# Altium schematic sheet MCU_BLE_Module.SchDoc
size Legal; SheetNumber: 2; SheetTotal: 4
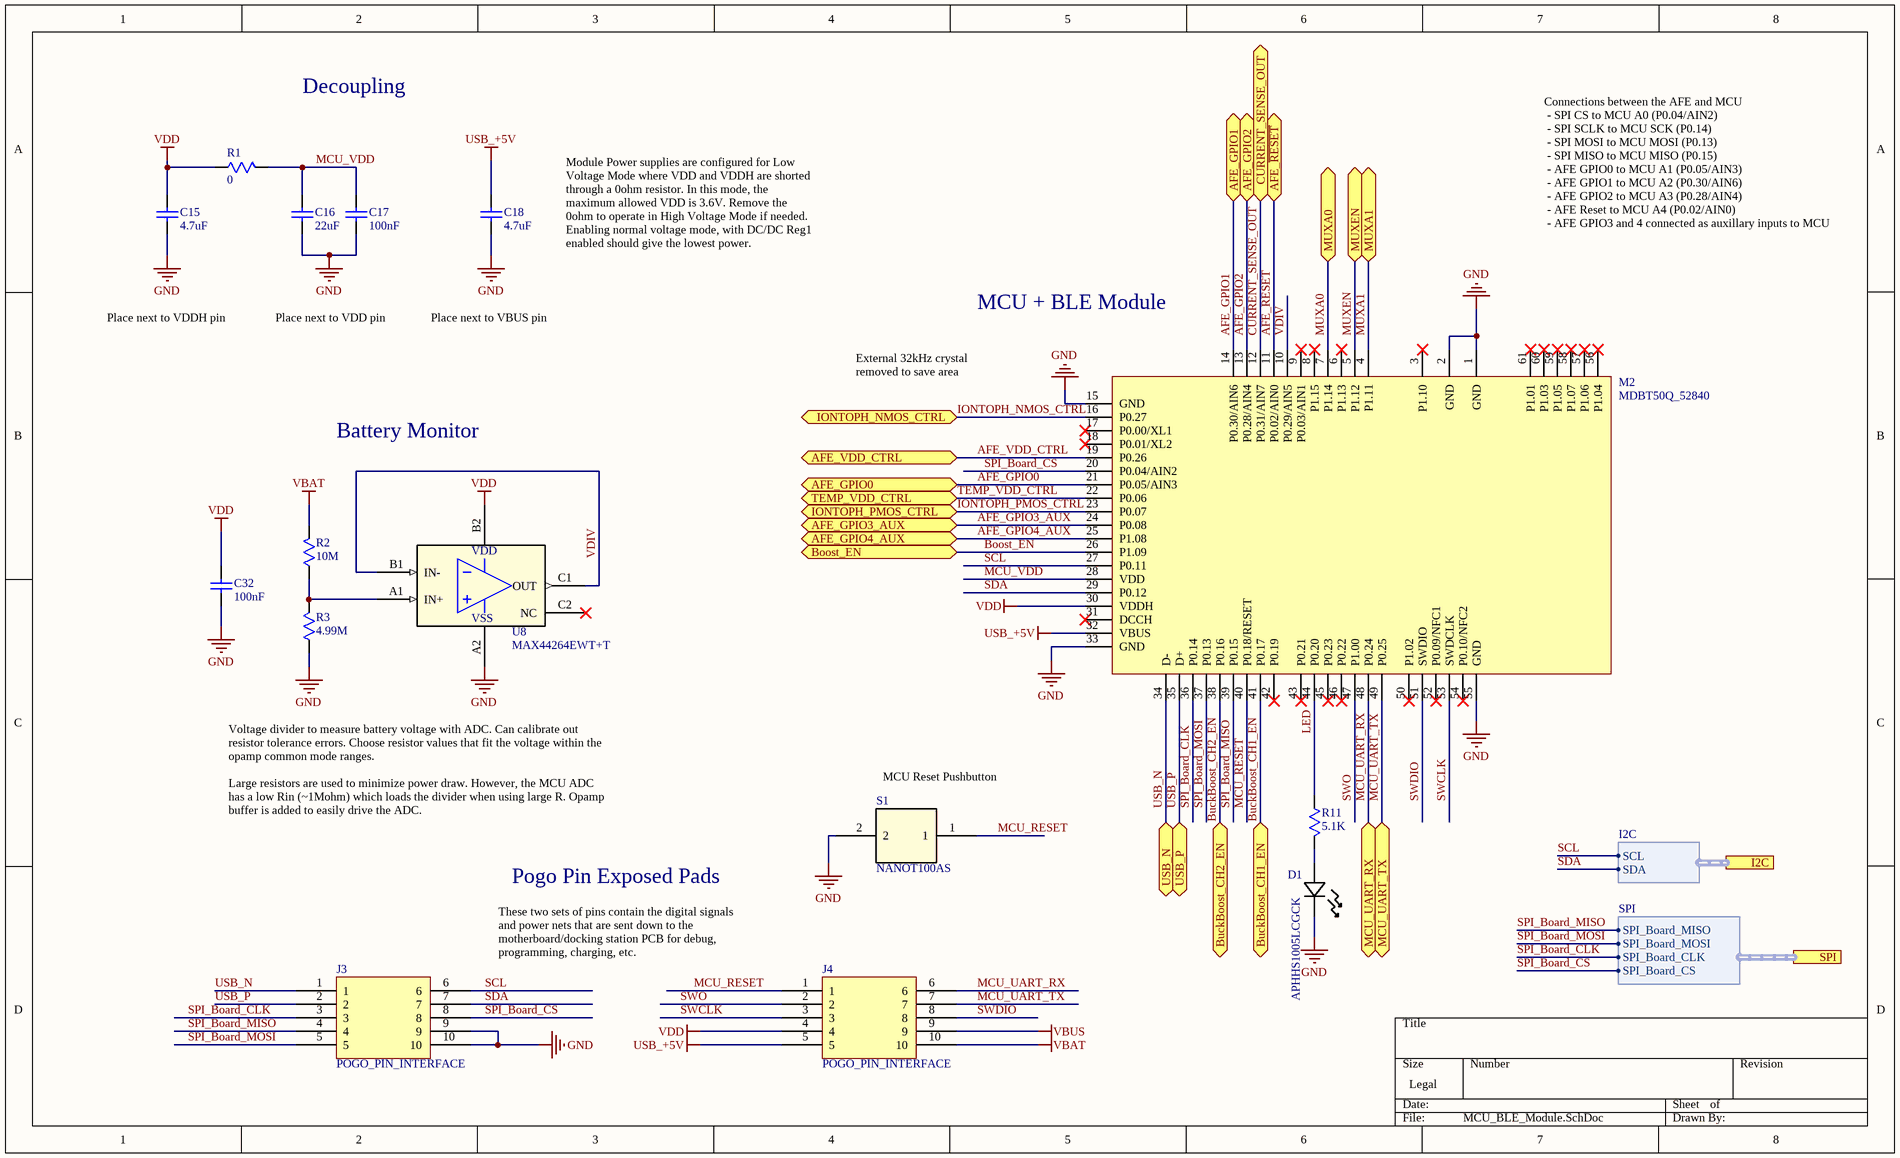
[diagram p0: MCU_BLE_Module.SchDoc]

## Parts
C15  value 4.7uF  [0201 cap]  (hidden comment: CAP)
C16  value 22uF  [0402-CAP]  (hidden comment: CAP)
C17  value 100nF  [0201 cap]  (hidden comment: CAP)
C18  value 4.7uF  [0201 cap]  (hidden comment: CAP)
C32  value 100nF  [0201 cap]  (hidden comment: CAP)
D1  APHHS1005LCGCK  [0402-LED]
J3  POGO_PIN_INTERFACE  [POGO_PIN_INTERFACE_10pin]
J4  POGO_PIN_INTERFACE  [POGO_PIN_INTERFACE_10pin]
M2  MDBT50Q_52840  [MDBT50Q]
R1  value 0  [0201 res]  (hidden comment: RES)
R2  value 10M  [0402-RES]  (hidden comment: RES)
R3  value 4.99M  [0402-RES]  (hidden comment: RES)
R11  value 5.1K  [0201 res]  (hidden comment: RES)
S1  NANOT100AS  [NANOT100AS_CNK-M]
U8  MAX44264EWT+T  [21-0217D_W61B1-1_MXM]

## Ports
AFE_GPIO0 (bidir), AFE_GPIO1 (bidir), AFE_GPIO2 (bidir), AFE_GPIO3_AUX (bidir), AFE_GPIO4_AUX (bidir), AFE_VDD_CTRL (bidir), AFE_~{RESET} (bidir), Boost_EN (bidir), BuckBoost_CH1_EN (bidir), BuckBoost_CH2_EN (bidir), CURRENT_SENSE_OUT (bidir), I2C (harness I2C), IONTOPH_NMOS_CTRL (bidir), IONTOPH_PMOS_CTRL (bidir), MCU_UART_RX (bidir), MCU_UART_TX (bidir), MUXA0 (bidir), MUXA1 (bidir), MUXEN (bidir), SPI (harness SPI), TEMP_VDD_CTRL (bidir), USB_N (bidir), USB_P (bidir)

## Harnesses
SPI: SPI_Board_MISO, SPI_Board_MOSI, SPI_Board_CLK, SPI_Board_CS
I2C: SCL, SDA

## Nets
GND: C15.2 C16.2 C17.2 C18.2 C32.2 D1.1 J3.9 J3.10 M2.1(GND) M2.2(GND) M2.15(GND) M2.33(GND) M2.55(GND) R3.1 S1.2 U8.A2(VSS)
USB_+5V: C18.1 J4.5 M2.32(VBUS)
VBAT: J4.10 R2.2
VBUS: J4.9
VDD: C15.1 C32.1 J4.4 M2.30(VDDH) R1.1 U8.B2(VDD)
AFE_GPIO0: M2.21(P0.05/AIN3) ; port AFE_GPIO0
AFE_GPIO1: M2.14(P0.30/AIN6) ; port AFE_GPIO1
AFE_GPIO2: M2.13(P0.28/AIN4) ; port AFE_GPIO2
AFE_GPIO3_AUX: M2.24(P0.08) ; port AFE_GPIO3_AUX
AFE_GPIO4_AUX: M2.25(P1.08) ; port AFE_GPIO4_AUX
AFE_~{RESET}: M2.11(P0.02/AIN0) ; port AFE_~{RESET}
AFE_VDD_CTRL: M2.19(P0.26) ; port AFE_VDD_CTRL
Boost_EN: M2.26(P1.09) ; port Boost_EN
BuckBoost_CH1_EN: M2.41(P0.17) ; port BuckBoost_CH1_EN
BuckBoost_CH2_EN: M2.38(P0.16) ; port BuckBoost_CH2_EN
CURRENT_SENSE_OUT: M2.12(P0.31/AIN7) ; port CURRENT_SENSE_OUT
IONTOPH_NMOS_CTRL: M2.16(P0.27) ; port IONTOPH_NMOS_CTRL
IONTOPH_PMOS_CTRL: M2.23(P0.07) ; port IONTOPH_PMOS_CTRL
LED: M2.44(P0.20) R11.1
MCU_RESET: J4.1 M2.40(P0.18/RESET) S1.1
MCU_UART_RX: J4.6 M2.48(P0.24) ; port MCU_UART_RX
MCU_UART_TX: J4.7 M2.49(P0.25) ; port MCU_UART_TX
MCU_VDD: C16.1 C17.1 M2.28(VDD) R1.2
MUXA0: M2.7(P1.14) ; port MUXA0
MUXA1: M2.4(P1.11) ; port MUXA1
MUXEN: M2.5(P1.12) ; port MUXEN
SCL: J3.6 M2.27(P0.11) ; port I2C.SCL
SDA: J3.7 M2.29(P0.12) ; port I2C.SDA
SPI_Board_CLK: J3.3 M2.36(P0.14) ; port SPI.SPI_Board_CLK
SPI_Board_CS: J3.8 M2.20(P0.04/AIN2) ; port SPI.SPI_Board_CS
SPI_Board_MISO: J3.4 M2.39(P0.15) ; port SPI.SPI_Board_MISO
SPI_Board_MOSI: J3.5 M2.37(P0.13) ; port SPI.SPI_Board_MOSI
SWCLK: J4.3 M2.53(SWDCLK)
SWDIO: J4.8 M2.51(SWDIO)
SWO: J4.2 M2.47(P1.00)
TEMP_VDD_CTRL: M2.22(P0.06) ; port TEMP_VDD_CTRL
USB_N: J3.1 M2.34(D-) ; port USB_N
USB_P: J3.2 M2.35(D+) ; port USB_P
VDIV: M2.10(P0.29/AIN5) U8.B1(IN-) U8.C1(OUT)
NetD1_2: D1.2 R11.2
NetR2_1: R2.1 R3.2 U8.A1(IN+)

Not connected (* = marked no-connect by the designer): M2 3(P1.10)* 6(P1.13)* 8(P1.15)* 9(P0.03/AIN1)* 17(P0.00/XL1)* 18(P0.01/XL2)* 31(DCCH)* 42(P0.19)* 43(P0.21)* 45(P0.23)* 46(P0.22)* 50(P1.02)* 52(P0.09/NFC1)* 54(P0.10/NFC2)* 56(P1.04)* 57(P1.06)* 58(P1.07)* 59(P1.05)* 60(P1.03)* 61(P1.01)*; U8 C2(NC)*

## Notes on the sheet
- Decoupling
- Connections between the AFE and MCU
  - SPI CS to MCU A0 (P0.04/AIN2)
  - SPI SCLK to MCU SCK (P0.14)
  - SPI MOSI to MCU MOSI (P0.13)
  - SPI MISO to MCU MISO (P0.15)
  - AFE GPIO0 to MCU A1 (P0.05/AIN3)
  - AFE GPIO1 to MCU A2 (P0.30/AIN6)
  - AFE GPIO2 to MCU A3 (P0.28/AIN4)
  - AFE Reset to MCU A4 (P0.02/AIN0)
  - AFE GPIO3 and 4 connected as auxillary inputs to MCU
- Module Power supplies are configured for Low Voltage Mode where VDD and VDDH are shorted through a 0ohm resistor. In this mode, the maximum allowed VDD is 3.6V. Remove the 0ohm to operate in High Voltage Mode if needed. Enabling normal voltage mode, with DC/DC Reg1 enabled should give the lowest power.
- Place next to VDDH pin
- Place next to VDD pin
- Place next to VBUS pin
- MCU + BLE Module
- External 32kHz crystal removed to save area
- Battery Monitor
- Voltage divider to measure battery voltage with ADC. Can calibrate out resistor tolerance errors. Choose resistor values that fit the voltage within the opamp common mode ranges.
  Large resistors are used to minimize power draw. However, the MCU ADC has a low Rin (~1Mohm) which loads the divider when using large R. Opamp buffer is added to easily drive the ADC.
- (near S1) MCU Reset Pushbutton
- Pogo Pin Exposed Pads
- These two sets of pins contain the digital signals and power nets that are sent down to the motherboard/docking station PCB for debug, programming, charging, etc.

## Library data of the parts
C15-C18 C32 = CAP SMD: Multilayer Chip Capacitor; Designer: OMIGA
D1 = APHHS1005LCGCK: Green LED 0402; Mfr_Name: Kingbright; Type: DEV; Copyright: Copyright (C) 2022 Ultra Librarian. All rights reserved.; Manufacturer_Part_Number: APHHS1005LCGCK; RefDes: RefDes
R1-R3 R11 = RES SMD: Surface Mount Resistor; Designer: OMIGA
S1 = NANOT100AS: Smallest Push Button Switch; Mfr_Name: C&K; Copyright: Copyright (C) 2022 Ultra Librarian. All rights reserved.; Manufacturer_Part_Number: NANOT100AS; Digi-Key_Part_Number_1: 108-NANOT100ASTR-ND; Digi-Key_Part_Number_2: 108-NANOT100ASCT-ND; Digi-Key_Part_Number_3: 108-NANOT100ASDKR-ND; RefDes: RefDes; Type: DEV
U8 = MAX44264EWT+T: No Description Available; Mfr_Name: Maxim Integrated Products; Copyright: Copyright (C) 2022 Ultra Librarian. All rights reserved.; Manufacturer_Part_Number: MAX44264EWT+T; RefDes: RefDes; Type: DEV